# Altium schematic sheet Sheet2 (1).SchDoc
size A; SheetNumber: 2; SheetTotal: 2
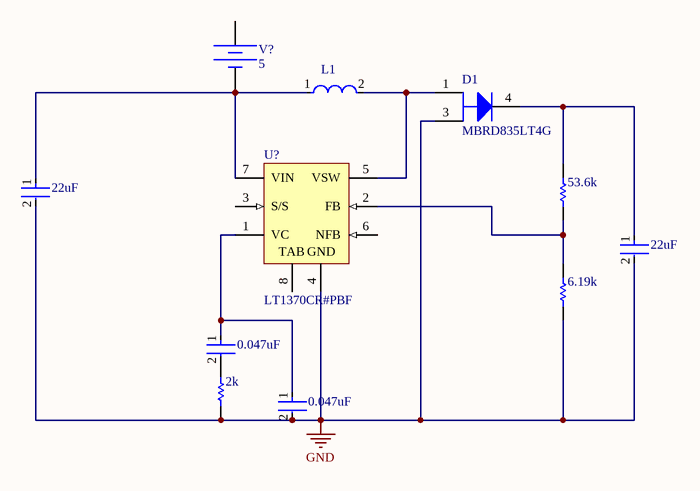
[diagram p0: Sheet2 (1).SchDoc]

## Parts
(Parts that share a designator on the sheet are numbered #1, #2 ... from top to bottom, then left to right.)
0.047uF#1  (no value)  [FP-GRM155-0_05-IPC_A]
0.047uF#2  (no value)  [FP-GRM155-0_05-IPC_A]
2k  (no value)  [RESC1609X50X30ML10T20]
6.19k  (no value)  [RESC1609X50X30NL10T20]
22uF#1  (no value)  [FP-GRM21B-0_15-MFG]
22uF#2  (no value)  [FP-GRM21B-0_15-MFG]
53.6k  (no value)  [RESC3216X60X45LL10T20]
D1  MBRD835LT4G  [ONSC-DPAK-3-369C-01_V]
L1  (no value)  [FP-B82422A-MFG]
U?  LT1370CR#PBF  [LT-R-7_L]
V?  DC Magnitude: 5  (hidden comment: Constant Voltage Source)

## Nets
GND: 0.047uF#2.2 2k.1 6.19k.1 22uF#1.2 22uF#2.2 D1.3(A) U?.4(GND)
Net0.047uF#1_1: 0.047uF#1.1 0.047uF#2.1 U?.1(VC)
Net0.047uF#1_2: 0.047uF#1.2 2k.2
Net6.19k_2: 6.19k.2 53.6k.2 U?.2(FB)
Net22uF#1_1: 22uF#1.1 L1.1 U?.7(VIN) V?.2
Net22uF#2_1: 22uF#2.1 53.6k.1 D1.4(K)
NetD1_1: D1.1(A) L1.2 U?.5(VSW)

Not connected (* = marked no-connect by the designer): U? 3(S/S) 6(NFB) 8(TAB); V? 1

## Library data of the parts
0.047uF#1 0.047uF#2 = CMP-2008-04595-2: Chip Multilayer Ceramic Capacitors for General Purpose, 0402, 47000pF, X7R, 15%, 10%, 10V; Capacitance: 47nF; Case Code (Imperial): 0402; Mount: Surface Mount; Termination: SMD/SMT; Thickness: 0.022inch; Max Operating Temperature: 125°C; REACH SVHC: No SVHC; Min Operating Temperature: -55°C; Voltage Rating: 10V; Packaging: Tape and Reel; Voltage Rating (DC): 10V; Case/Package: 0402; Tolerance: 10%; Package Quantity: 1; Depth: 0.5mm; Width: 0.5mm; Height: 0.5mm; Lead Free: Lead Free; Dielectric: X7R; Length: 1mm; Radiation Hardening: No; Case Code (Metric): 1005; Material: Ceramic; Voltage: 10V
2k = CMP-2000-03159-1: Manufacturer: Vishay Dale; Part Number: CRCW06032K00FKEA
6.19k = CMP-1012-00600-2: Part Number: CRCW06036K19FKEA; Manufacturer: Vishay Dale
22uF#1 22uF#2 = CMP-2007-03385-2: Chip Multilayer Ceramic Capacitors for General Purpose, 0805, 22uF, X5R, 15%, 20%, 6.3V; Material: Ceramic; Max Operating Temperature: 85°C; Voltage: 6.3V; Min Operating Temperature: -55°C; Case/Package: 0805; Thickness: 0.053inch; Dielectric: X5R; Packaging: Tape and Reel; Depth: 1.25mm; Termination: SMD/SMT; Voltage Rating (DC): 6.3V; Radiation Hardening: No; Tolerance: 20%; Mount: Surface Mount; Lead Free: Lead Free; Package Quantity: 1; REACH SVHC: No SVHC; Voltage Rating: 6.3V; Capacitance: 22uF; Length: 2mm; Case Code (Imperial): 0805; Case Code (Metric): 2012; Width: 0.049inch; Height: 1.25mm
53.6k = CMP-2003-02270-1: Part Number: CRCW120653K6FKEA; Manufacturer: Vishay Dale
D1 = CMP-1055-00173-1: SWITCHMODE(TM) Power Rectifier, 3-Pin DPAK, Pb-Free, Tape and Reel; Manufacturer: On Semiconductor; IFSM Max (A): 75; Configuration: Single; ComponentLink3URL: http://www.onsemi.cn/pub_link/Collateral/369C.PDF; ComponentLink2URL: http://www.onsemi.cn/pub_link/Collateral/MBRD835L-D.PDF; RoHS: TRUE; PackageVersion: Rev. E, 02/2014; Mounting Technology: Surface Mount; PackageDescription: 3-Pin Flange Mount, Body 6.54 x 6.095 mm, Pitch 2.29 mm; PartNumber: MBRD835LT4G; ComponentLink1URL: http://www.onsemi.com/; PackageReference: DPAK-3-369C-01; Packing: Tape and Reel; ComponentLink1Description: Manufacturer URL; ComponentLink2Description: Datasheet; DatasheetVersion: Rev. 11; ComponentLink3Description: Package Specification
L1 = CMP-2000-05912-2: FIXED IND 10UH 180MA 1.6 OHM SMD; Tolerance: 10%; Core Material: Ferrite; Q Factor: 27; Self Resonant Frequency: 25MHz; Shielding: Unshielded; Test Frequency: 1MHz; Series Resistance: 1.6R; Radiation Hardening: No; REACH SVHC: No SVHC; Width: 0.098inch; RoHS Compliant: Yes; Case/Package: 1210; DC Current: 180mA; Package Quantity: 2000; Height - Seated (Max): 0.083inch; Rated Current-Max: 180mA; Series: SIMID; Mount: Surface Mount; Depth: 2.8mm; Resistor Type: Wirewound; Max DC Current: 180mA; Termination: SMD/SMT; Contact Plating: Tin; Height: 2.1mm; Inductance: 10uH; Case Code (Metric): 3225; Lead Free: Lead Free; Weight: 0.001764oz; Max Operating Temperature: 125°C; Length: 3.5mm; Packaging: Tape and Reel; Case Code (Imperial): 1210; Inductance Tolerance: 10%; Ratings: AEC-Q200; Number of Pins: 2; Current Rating: 180mA; Military Standard: Not; DC Resistance (DCR): 1.6R
U? = CMP-0491-01357-1: 500 kHz High Efficiency 6 A Switching Regulator, 7-pin DPAK (R-7), 0 to 125 degC, Pb-Free; Manufacturer: Linear Technology; Number of Outputs: 1; Frequency Sync Range: 600kHz - 800kHz; RoHS: TRUE; ComponentLink3URL: http://cds.linear.com/docs/en/packaging/05081462_F_R.pdf; PackageReference: R-7; PartNumber: LT1370CR#PBF; ComponentLink2Description: Datasheet; ComponentLink1Description: Manufacturer URL; PackageDescription: 7-Pin Plastic DD Pak, Body 10.2235 x 8.89 mm, Pitch 1.27 mm; ComponentLink2URL: http://cds.linear.com/docs/en/datasheet/1370fs.pdf; ComponentLink3Description: Package Specification; PackageVersion: Rev. F, 05/2012; ComponentLink1URL: http://www.linear.com/; Mounting Technology: Surface Mount
V? = Battery: SimulationGenericComponent: True